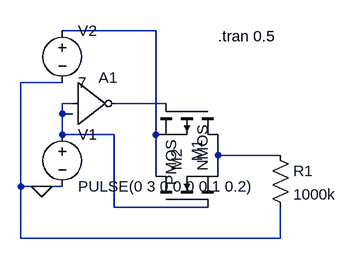
[diagram p0: schematic Draft50.asc]
Draft50.asc, the LTspice schematic file:
Version 4
SHEET 1 880 680
WIRE 416 128 272 128
WIRE 272 208 208 208
WIRE 288 240 272 240
WIRE 432 240 352 240
WIRE 272 256 272 240
WIRE 288 256 272 256
WIRE 272 288 272 256
WIRE 352 288 272 288
WIRE 416 288 416 128
WIRE 512 320 512 288
WIRE 608 320 512 320
WIRE 416 352 416 288
WIRE 512 352 512 320
WIRE 208 368 208 208
WIRE 240 368 208 368
WIRE 272 368 240 368
WIRE 352 400 352 288
WIRE 496 400 352 400
WIRE 208 448 208 368
WIRE 608 448 608 400
WIRE 608 448 208 448
FLAG 240 368 0
SYMBOL voltage 272 272 R0
SYMATTR InstName V1
SYMATTR Value PULSE(0 3 0 0 0 0.1 0.2)
SYMBOL voltage 272 112 R0
SYMATTR InstName V2
SYMATTR Value 7
SYMBOL pmos 512 240 R90
SYMATTR InstName M1
SYMBOL nmos 416 400 R270
SYMATTR InstName M2
SYMBOL Digital/inv 288 176 R0
SYMATTR InstName A1
SYMBOL res 592 304 R0
SYMATTR InstName R1
SYMATTR Value 1000k
TEXT 512 136 Left 2 !.tran 0.5

The netlist it stands for:
* Draft50.asc
V1 N002 0 PULSE(0 3 0 0 0 0.1 0.2)
V2 N001 0 7
M1 N004 N003 N001 N001 PMOS
M2 N001 N002 N004 N004 NMOS
A1 N002 N002 N002 N002 N002 N003 N002 N002 BUF
R1 N004 0 1000k
.model NMOS NMOS
.model PMOS PMOS
.lib standard.mos
.tran 0.5
.backanno
.end